# Altium schematic sheet NVME.SchDoc
size C; SheetNumber: 5; SheetTotal: 21
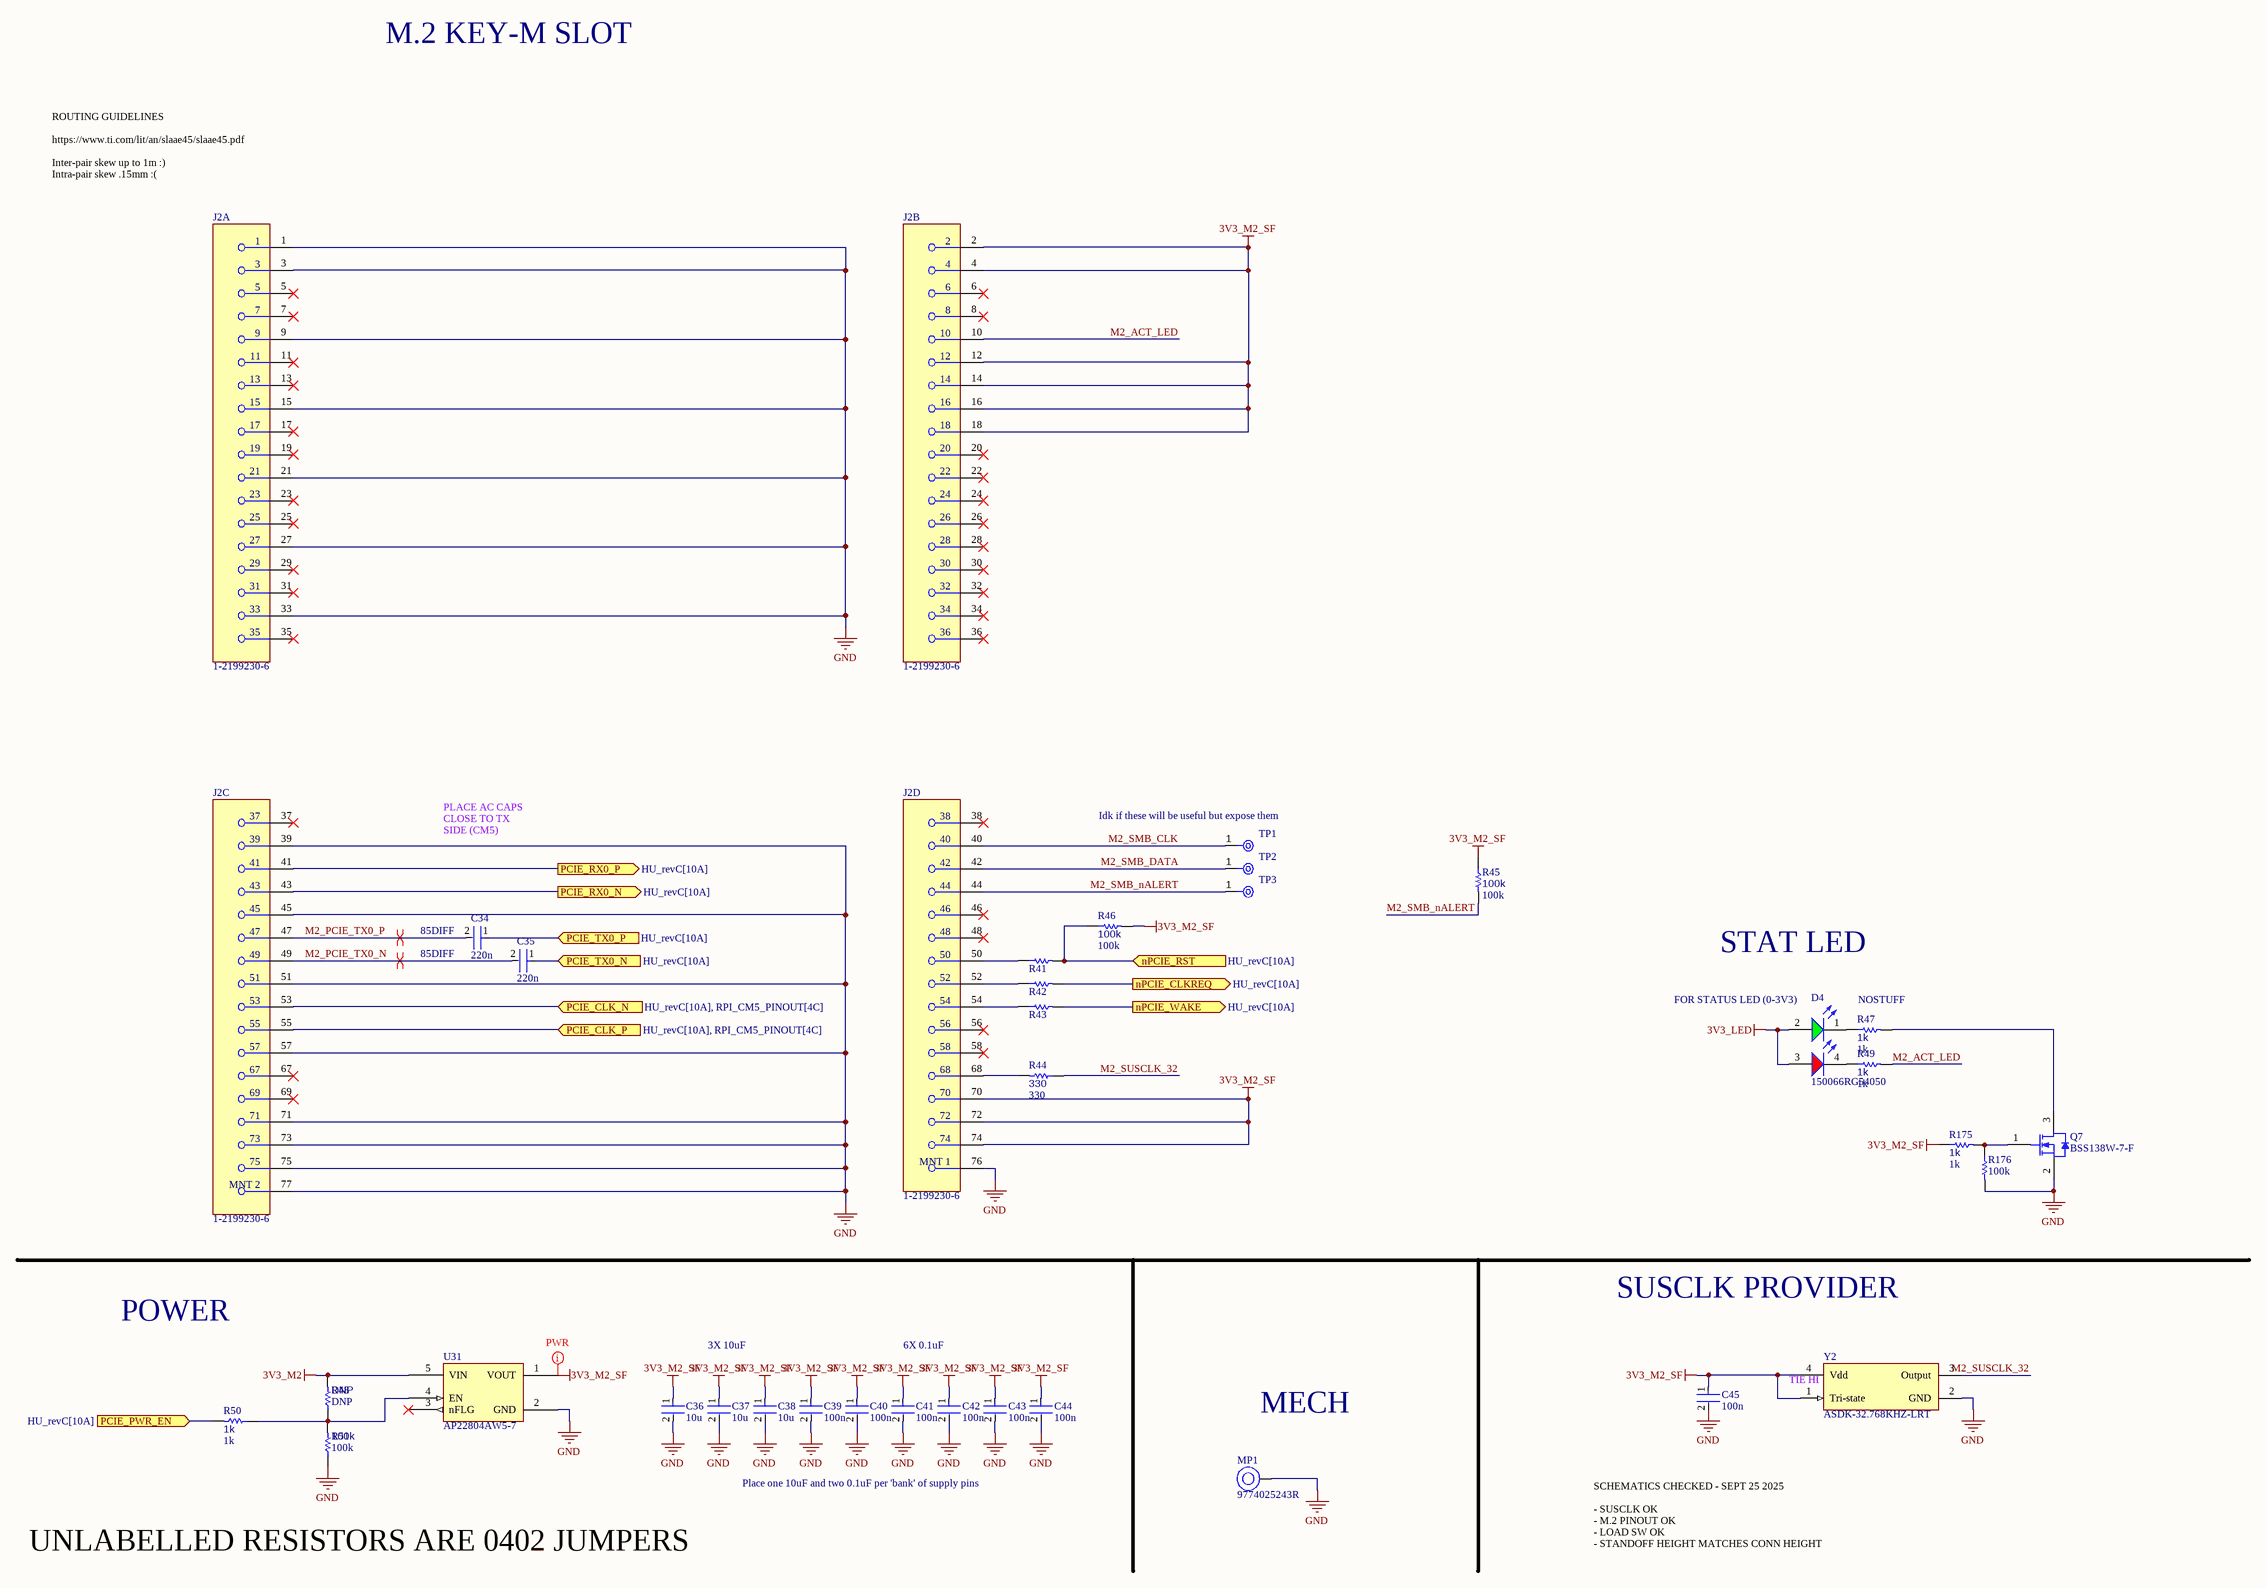
[diagram p0: NVME.SchDoc]

## Parts
C34  220n  [FP-0402-L_1_0_0_05-W_0_5-IPC_A]
C35  220n  [FP-0402-L_1_0_0_05-W_0_5-IPC_A]
C36  10u  [FP-0402-L_1_0_0_05-W_0_5-IPC_A]
C37  10u  [FP-0402-L_1_0_0_05-W_0_5-IPC_A]
C38  10u  [FP-0402-L_1_0_0_05-W_0_5-IPC_A]
C39  100n  [FP-0402-L_1_0_0_05-W_0_5-IPC_A]
C40  100n  [FP-0402-L_1_0_0_05-W_0_5-IPC_A]
C41  100n  [FP-0402-L_1_0_0_05-W_0_5-IPC_A]
C42  100n  [FP-0402-L_1_0_0_05-W_0_5-IPC_A]
C43  100n  [FP-0402-L_1_0_0_05-W_0_5-IPC_A]
C44  100n  [FP-0402-L_1_0_0_05-W_0_5-IPC_A]
C45  100n  [FP-0402-L_1_0_0_05-W_0_5-IPC_A]
D4  150066RG54050  [WL-SBCD_0606]
J2  1-2199230-6  [FP-1-2199230-6-MFG]  (parts A,B,C,D of 4)
MP1  9774025243R  [9774025243]
Q7  BSS138W-7-F  [DIOD-SOT323-3_V]
R41  0402 JUMPER  [RESC1005X40X25ML05T05]  (value not drawn)
R42  0402 JUMPER  [RESC1005X40X25ML05T05]  (value not drawn)
R43  0402 JUMPER  [RESC1005X40X25ML05T05]  (value not drawn)
R44  330  [R0603B]
R45  100k  [R0603B]
R46  100k  [R0603B]
R47  1k  [R0603B]
R48  DNP  [R0603B]
R49  1k  [R0603B]
R50  1k  [R0603B]
R51  100k  [R0603B]
R175  1k  [R0603B]
R176  100k  [R0603B]
TP1  TPAD6R  [New footprint 1]  (value not drawn)
TP2  TPAD6R  [New footprint 1]  (value not drawn)
TP3  TPAD6R  [New footprint 1]  (value not drawn)
U31  AP22804AW5-7  [SOT95P285X140-5N]
Y2  ASDK-32.768KHZ-LRT  [FP-ASDK-MFG]

## Ports
nPCIE_CLKREQ (out, see HU_revC[10A]), nPCIE_RST (in, see HU_revC[10A]), nPCIE_WAKE (out, see HU_revC[10A]), PCIE_CLK_N (in, see HU_revC[10A], RPI_CM5_PINOUT[4C]), PCIE_CLK_P (in, see HU_revC[10A], RPI_CM5_PINOUT[4C]), PCIE_PWR_EN (in, see HU_revC[10A]), PCIE_RX0_N (out, see HU_revC[10A]), PCIE_RX0_P (out, see HU_revC[10A]), PCIE_TX0_N (in, see HU_revC[10A]), PCIE_TX0_P (in, see HU_revC[10A])

## Nets
3V3_LED: D4.2(A) D4.3(A)
3V3_M2: R48.2 U31.5(VIN)
3V3_M2_SF: C36.1 C37.1 C38.1 C39.1 C40.1 C41.1 C42.1 C43.1 C44.1 C45.1 J2.2 J2.4 J2.12 J2.14 J2.16 J2.18 J2.70 J2.72 J2.74 R45.1 R46.2 R175.1 U31.1(VOUT) Y2.1(Tri-state) Y2.4(Vdd)
GND: C36.2 C37.2 C38.2 C39.2 C40.2 C41.2 C42.2 C43.2 C44.2 C45.2 J2.1 J2.3 J2.9 J2.15 J2.21 J2.27 J2.33 J2.39 J2.45 J2.51 J2.57 J2.71 J2.73 J2.75 J2.76(MNT_1) J2.77(MNT_2) MP1.1 Q7.2(S) R51.1 R176.2 U31.2(GND) Y2.2(GND)
M2_ACT_LED: J2.10 R49.2
M2_PCIE_TX0_N: C35.2 J2.49
M2_PCIE_TX0_P: C34.2 J2.47
M2_SMB_CLK: J2.40 TP1.1(TP)
M2_SMB_DATA: J2.42 TP2.1(TP)
M2_SMB_nALERT: J2.44 R45.2 TP3.1(TP)
M2_SUSCLK_32: R44.1 Y2.3(Output)
nPCIE_CLKREQ: R42.2 ; port nPCIE_CLKREQ
nPCIE_RST: R41.2 R46.1 ; port nPCIE_RST
nPCIE_WAKE: R43.2 ; port nPCIE_WAKE
PCIE_CLK_N: J2.53 ; port PCIE_CLK_N
PCIE_CLK_P: J2.55 ; port PCIE_CLK_P
PCIE_PWR_EN: R50.2 ; port PCIE_PWR_EN
PCIE_RX0_N: J2.43 ; port PCIE_RX0_N
PCIE_RX0_P: J2.41 ; port PCIE_RX0_P
PCIE_TX0_N: C35.1 ; port PCIE_TX0_N
PCIE_TX0_P: C34.1 ; port PCIE_TX0_P
NetD4_1: D4.1(K) R47.1
NetD4_4: D4.4(K) R49.1
NetJ2_50: J2.50 R41.1
NetJ2_52: J2.52 R42.1
NetJ2_54: J2.54 R43.1
NetJ2_68: J2.68 R44.2
NetQ7_1: Q7.1(G) R175.2 R176.1
NetQ7_3: Q7.3(D) R47.2
NetR48_1: R48.1 R50.1 R51.2 U31.4(EN)

Not connected (* = marked no-connect by the designer): J2 5* 6* 7* 8* 11* 13* 17* 19* 20* 22* 23* 24* 25* 26* 28* 29* 30* 31* 32* 34* 35* 36* 37* 38* 46* 48* 56* 58* 67* 69*; U31 3(nFLG)*

## Layout directives
net class PWR: 3V3_M2_SF
differential pair; differential pair class 85DIFF: M2_PCIE_TX0_N, M2_PCIE_TX0_P

## Notes on the sheet
- M.2 KEY-M SLOT
- ROUTING GUIDELINES
  https://www.ti.com/lit/an/slaae45/slaae45.pdf
  Inter-pair skew up to 1m :)
  Intra-pair skew .15mm :(
- (near TP1) Idk if these will be useful but expose them
- PLACE AC CAPS CLOSE TO TX SIDE (CM5)
- STAT LED
- (near D4) FOR STATUS LED (0-3V3)
- (near R47) NOSTUFF
- POWER
- SUSCLK PROVIDER
- 3X 10uF
- 6X 0.1uF
- (near Y2) TIE HI
- MECH
- Place one 10uF and two 0.1uF per 'bank' of supply pins
- UNLABELLED RESISTORS ARE 0402 JUMPERS
- SCHEMATICS CHECKED - SEPT 25 2025
  - SUSCLK OK
  - M.2 PINOUT OK
  - LOAD SW OK
  - STANDOFF HEIGHT MATCHES CONN HEIGHT

## Library data of the parts
C34-C45 = CMP-001-00058-1: LARGE PADS, 0402 CAP, CHANGE COMMENT TO MATCH REAL P/N; Capacitor Type: Ceramic; Min Operating Temperature: -55°C; Mounting Technology: Surface Mount; Pins: 2; Case/Package: 0402; RoHS Compliant: Yes; Max Operating Temperature: 85°C
D4 = CMP-004-00040-2: Led, Red/Grn, 180Mcd/230Mcd, 624Nm/525Nm Rohs Compliant: Yes; Source: rgled.SchLib; Component Type: Standard; Pins: 4; Design Item ID: CMP-004-00034-2
J2 = CMP-03365-000001-1: CONN EDGE DUAL FMALE 67POS 0.020; Manufacturer: TE; Number Of Contacts: 67; Current Rating: 0.5A; Pitch: 0.5mm; Conn Gender: Female; Is Female: yes; Voltage Rating: 50V; Conn Orientation: Right Angle; Automotive: No; Temperature Range High: +80°C; Package: 1-2199230-6; Category: Conn; Temperature: -40°C to +80°C; Number Of Rows: 2; ComponentLink2URL: http://www.te.com/commerce/DocumentDelivery/DDEController?Action=showdoc&DocId=Specification+Or+Standard%7F114-115006%7FB%7Fpdf%7FEnglish%7FENG_SS_114-115006_B_114-115006_REV_B.pdf%7F1-2199230-6; Manufacturer Part Number: 1-2199230-6; Height: 4.2mm; RoHS: TRUE; Footprint Url: http://www.te.com/commerce/DocumentDelivery/DDEController?Action=showdoc&DocId=Customer+Drawing%7F2199230%7FB2%7Fpdf%7FEnglish%7FENG_CD_2199230_B2.pdf%7F1-2199230-6; Digikey Description: CONN EDGE DUAL FMALE 67POS 0.020; Device Class L2: Card Edge Connectors; Contact Material: Gold,Tin; Device Class L1: Connectors; Device Class L3: unset; ComponentLink2Description: Datasheet; Temperature Range Low: -40°C; Octopart: https://octopart.com/1-2199230-6-te+connectivity-34969376; Lead Free: Yes
MP1 = CMP-03913-59774857-1: 9774025243R Spacer Material: Steel, Tin-Plated Mounting: SMT Series: WA-SMST Thread D: M2; Outside Diameter: 4.3434mm; Threaded/Unthreaded: Threaded; Plating: Tin; REACH SVHC: Unknown; NexarPartId: 59774857; RoHS: Compliant; Material: Steel; Packaging: Tape and Reel; Max Operating Temperature: 150°C; Min Operating Temperature: -55°C; Length: 2.5mm; Height: 2.5mm
Q7 = CMP-2000-05968-1: N-Channel Enhancement Mode Mosfet, 50 V, 200 mA, -55 to 150 degC, 6-Pin SOT-323, RoHS, Tape and Reel; Typical Turn-Off Delay Time: 20ns; Number of Channels: 1Channel; Type: EnhancementModeFieldEffectTransistor; Brand: DiodesIncorporated; Vds - Drain-Source Breakdown Voltage: 75V; Vgs - Gate-Source Voltage: 20V; Rds On - Drain-Source Resistance: 1.4Ohms; Transistor Type: 1N-Channel; Configuration: Single; Unit Weight: 0.000212oz; Pd - Power Dissipation: 200mW; Id - Continuous Drain Current: 200mA; Forward Transconductance - Min: 0.1S; Manufacturer URL: http://www.diodes.com/; Series: BSS138; Package Description: 3-Pin Small Outline Transistor, Body 2 x 1.25 mm, Pitch 0.65 mm; Mounting Technology: SurfaceMount; Product Category: MOSFET; RoHS: True; Maximum Operating Temperature: +150C; Height: 1mm; Length: 2.2mm; Technology: Si; Width: 1.35mm; Datasheet URL: http://www.diodes.com/_files/datasheets/ds30206.pdf; Manufacturer: DiodesIncorporated; Package / Case: SOT-323-3; Typical Turn-On Delay Time: 20ns; Transistor Polarity: N-Channel; Factory Pack Quantity: 3000; Packaging: Reel; Product: MOSFETSmallSignal; Datasheet Version: Rev. 11-2, 09/2013; Package Reference: SOT323; Minimum Operating Temperature: -55C; Mounting Style: SMD/SMT; Channel Mode: Enhancement
R41-R43 = CMP-009-00118-2: READ THE NAME; Pins: 2; Component Type: Standard; Design Item ID: CMP-009-00206-2; Source: 0402jump.SchLib
R44-R51 R175 R176 = CMP-009-00002-14: Resistor
  R44: Value: 330
  R45 R46 R51 R176: Value: 100k
  R47 R49 R50 R175: Value: 1k
  R48: Value: DNP
TP1-TP3 = CMP-00025-2: Test Point .6mm
U31 = CMP-019-00060-1: SINGLE CHANNEL POWER DISTRIBUTION LOAD SWITCH, -40 to 85°C pF, RoHS; Max Supply Voltage: 5.5V; Min Supply Voltage: 2.7V; Max Operating Temperature: 85°C; Min Operating Temperature: -40°C
Y2 = CMP-27762-001115-1: XTAL OSC XO 32.7680KHZ CMOS SMD; Load Capacitance: 15pF; Max Supply Current: 3.5mA; Min Supply Voltage: 2.97V; Operating Supply Voltage: 3.3V; Frequency Stability: 25ppm; Lead Free: Lead Free; Case/Package: CSMD; Number of Pins: 4; Max Operating Temperature: 85°C; Packaging: Tape and Reel; Width: 0.079inch; Min Operating Temperature: -40°C; Radiation Hardening: No; Length: 2.5mm; Depth: 2mm; Termination: SMD/SMT; Height: 0.037inch; Series: ASDK; Frequency: 32.768kHz; Mount: Surface Mount